# EAGLE design Astable-555-Timer (EAGLE 9.6.2)
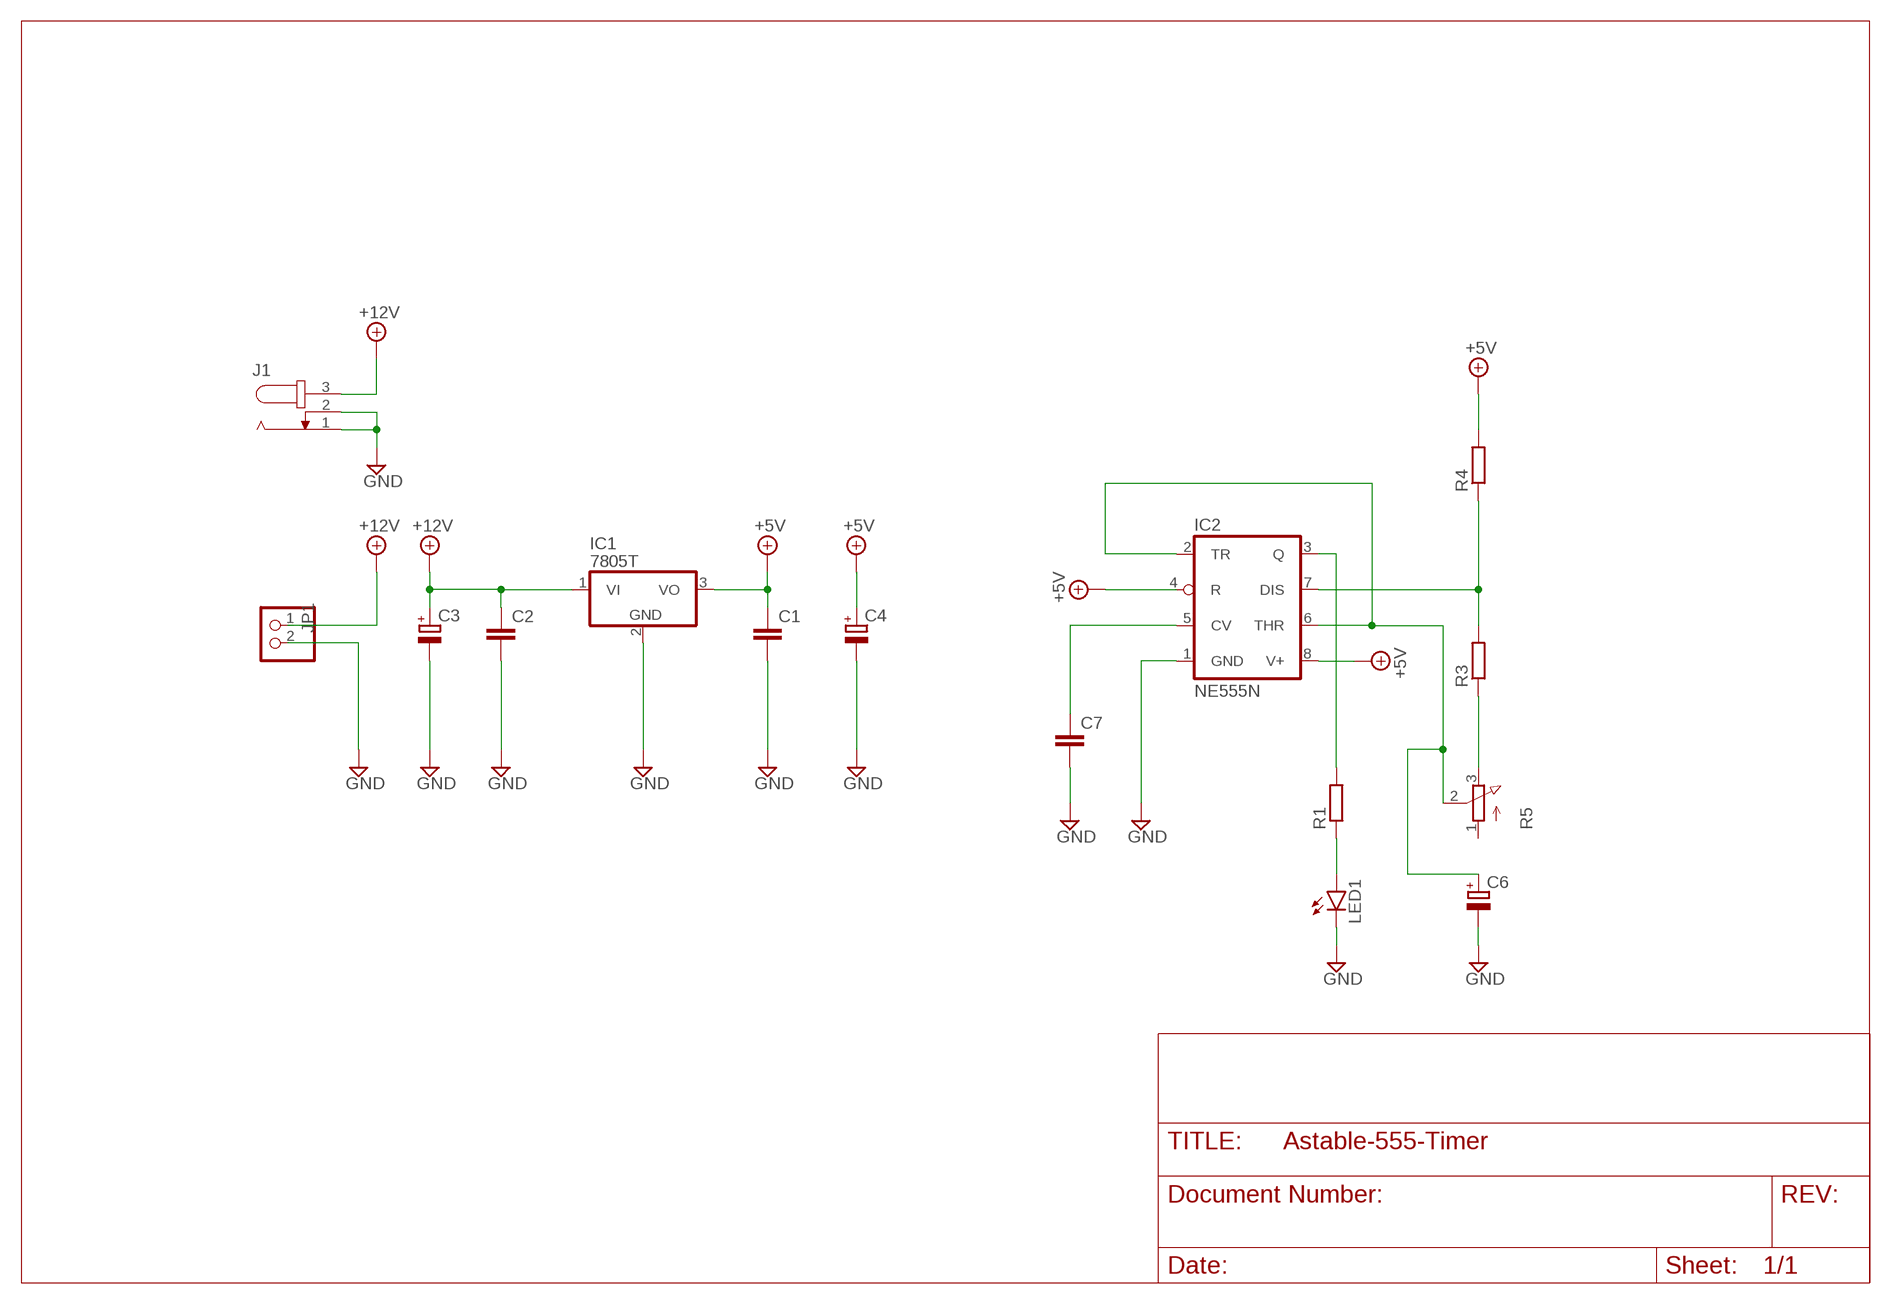
[diagram p0: schematic, sheet 1]

## Parts
C1  C-EU050-030X075  [C050-030X075]
C2  C-EU050-030X075  [C050-030X075]
C3  CPOL-EUE3.5-8  [E3,5-8]
C4  CPOL-EUE3.5-8  [E3,5-8]
C6  CPOL-EUE3.5-8  [E3,5-8]
C7  C-EU050-030X075  [C050-030X075]
IC1  7805T  [TO220H]
IC2  NE555N  [DIL08]
J1  JACK-PLUG1  [SPC4078]
JP1  PINHD-1X2  [1X02]
LED1  LED5MM  [LED5MM]
R1  R-EU_0207/10  [0207/10]
R3  R-EU_0207/10  [0207/10]
R4  R-EU_0207/10  [0207/10]
R5  3RP/1610N  [3RP/1610N]

## Nets
+5V [power]: C1.1 C4.+ IC1.3(VO) IC2.4(R) IC2.8(V+) R4.2
+12V [power]: C2.1 C3.+ IC1.1(VI) J1.3 JP1.1
GND [power]: C1.2 C2.2 C3.- C4.- C6.- C7.2 IC1.2(GND) IC2.1(GND) J1.1 J1.2 JP1.2 LED1.K(C)
N$2: C7.1 IC2.5(CV)
N$3: C6.+ IC2.2(TR) IC2.6(THR) R5.2(S)
N$4: IC2.7(DIS) R3.2 R4.1
N$5: R3.1 R5.3(E)
N$6: LED1.A R1.1
N$7: IC2.3(Q) R1.2
Unconnected: R5.1(A)

## Library data of the parts
C1 C2 C7 = rcl:C-EU: CAPACITOR, European symbol; SPICEPREFIX: C
C3 C4 C6 = rcl:CPOL-EU: POLARIZED CAPACITOR, European symbol; SPICEPREFIX: C
IC1 = linear:78*: Positive VOLTAGE REGULATOR Source: http://cache.national.com/ds/LM/LM78L05.pdf http://www.fairchildsemi.com/ds/LM/LM7805.pdf
IC2 = linear:*555: TIMER
J1 = con-jack:JACK-PLUG: DC POWER JACK Power Jack, DC, Right Angle, Through Hole, Rated 5A at 16VDC, PC Terminals Distributor: Farnell (www.Farnell.de) Drawing: 84N1161.pdf / 84N1162.pdf Manufacturer: SPC Technology (www.spctechnology.com) Type: SPC4077 / SPC 4078; OC_FARNELL: unknown; OC_NEWARK: unknown
JP1 = pinhead:PINHD-1X2: PIN HEADER
LED1 = led:LED: LED OSRAM: - CHIPLED LG R971, LG N971, LY N971, LG Q971, LY Q971, LO R971, LY R971 LH N974, LH R974 LS Q976, LO Q976, LY Q976 LO Q996 - Hyper CHIPLED LW Q18S LB Q993, LB Q99A, LB R99A - SideLED LS A670, LO A670, LY A670, LG A670, LP A670 LB A673, LV A673, LT A673, LW A673 LH A674 LY A675 LS A676, LA A676, LO A676, LY A676, LW A676 LS A679, LY A679, LG A679 - Hyper Micro SIDELED® LS Y876, LA Y876, LO Y876, LY Y876 LT Y87S - SmartLED LW L88C, LW L88S LB L89C, LB L89S, LG L890 LS L89K, LO L89K, LY L89K LS L896, LA L896, LO L896, LY L896 - TOPLED LS T670, LO T670, LY T670, LG T670, LP T670 LSG T670, LSP T670, LSY T670, LOP T670, LYG T670 LG T671, LOG T671, LSG T671 LB T673, LV T673, LT T673, LW T673 LH T674 LS T676, LA T676, LO T676, LY T676, LB T676, LH T676, LSB T676, LW T676 LB T67C, LV T67C, LT T67C, LS T67K, LO T67K, LY T67K, LW E67C LS E67B, LA E67B, LO E67B, LY E67B, LB E67C, LV E67C, LT E67C LW T67C LS T679, LY T679, LG T679 LS T770, LO T770, LY T770, LG T770, LP T770 LB T773, LV T773, LT T773, LW T773 LH T774 LS E675, LA E675, LY E675, LS T675 LS T776, LA T776, LO T776, LY T776, LB T776 LHGB T686 LT T68C, LB T68C - Hyper Mini TOPLED® LB M676 - Mini TOPLED Santana® LG M470 LS M47K, LO M47K, LY M47K Source: http://www.osram.convergy.de LUXEON: - LUMILED® LXK2-PW12-R00, LXK2-PW12-S00, LXK2-PW14-U00, LXK2-PW14-V00 LXK2-PM12-R00, LXK2-PM12-S00, LXK2-PM14-U00 LXK2-PE12-Q00, LXK2-PE12-R00, LXK2-PE12-S00, LXK2-PE14-T00, LXK2-PE14-U00 LXK2-PB12-K00, LXK2-PB12-L00, LXK2-PB12-M00, LXK2-PB14-N00, LXK2-PB14-P00, LXK2-PB14-Q00 LXK2-PR12-L00, LXK2-PR12-M00, LXK2-PR14-Q00, LXK2-PR14-R00 LXK2-PD12-Q00, LXK2-PD12-R00, LXK2-PD12-S00 LXK2-PH12-R00, LXK2-PH12-S00 LXK2-PL12-P00, LXK2-PL12-Q00, LXK2-PL12-R00 Source: www.luxeon.com KINGBRIGHT: KA-3528ASYC Source: www.kingbright.com
R1 R3 R4 = rcl:R-EU_: RESISTOR, European symbol; SPICEPREFIX: R
R5 = pot:3RP/1610N: 16mm Potentiometer one level Source: http://www.alphapotentiometers.net/html/16mm_pot_2.html

## Net classes
0 default: width 0.305 mm, drill 0.305 mm, clearance 0.254 mm
1 power: width 0.406 mm, drill 0.406 mm, clearance 0.305 mm

## Board
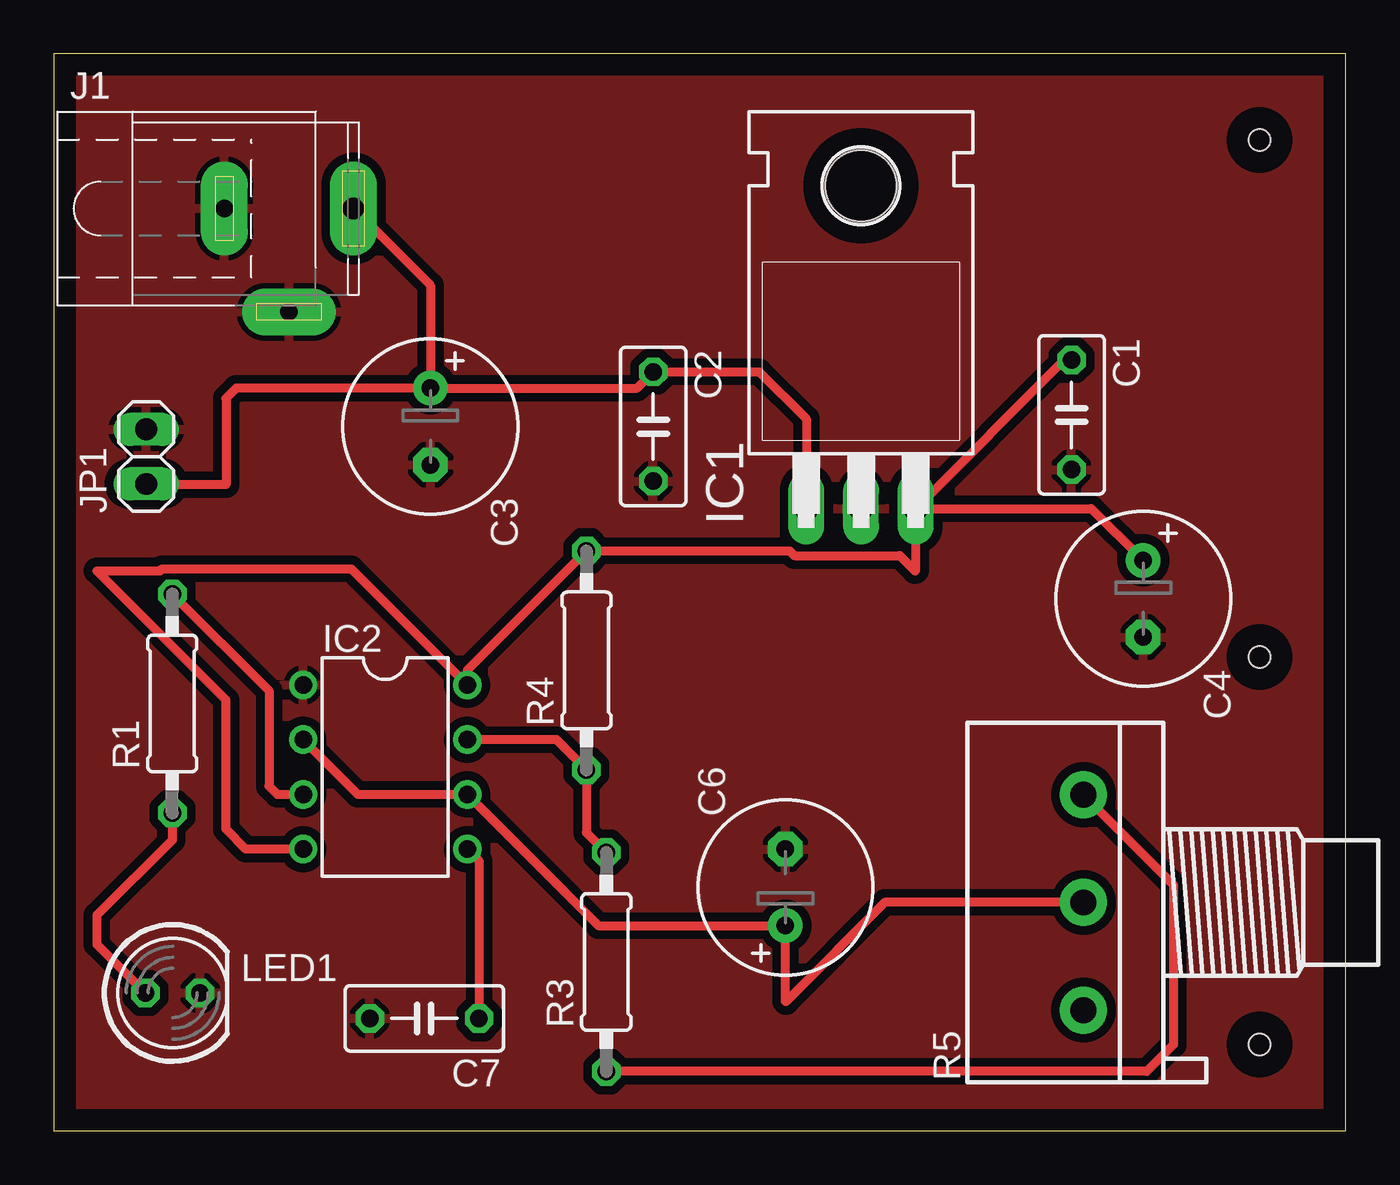
[diagram p1: board, top side]

Size 60 x 50 mm. Coordinates in mm from the lower left corner, seen from the top.
Outline: 0,0 60,0 60,50 0,50 0,0
Copper layers (1*16): Top 0.035mm / dielectric 1.5mm / Bottom 0.035mm
Design rules "default": minimum track width 6mil, minimum drill 0.35mm, track to track 6mil, track to pad 6mil, pad to pad 6mil, via to via 6mil, smd to smd 6mil, copper to edge 40mil, drill to drill 6mil, minimum pad ring 10mil, minimum via ring 8mil, stop-mask expansion 4mil, vias tented up to drill 0mil, thermal gap 10mil
Holes 1 mm at 56,46 56,4 56,22

### Footprints (pad centres in the part's own frame; a part is rotated, then mirrored left to right if it is on the bottom)
C050-030X075 = drill 0.813 octagon: 1 -2.54,0; 2 2.54,0
E3,5-8 = drill 0.813 pad 1.6: + -1.778,0 | drill 0.813 pad 1.6 octagon: - 1.778,0
TO220H = drill 1.118 long: 1 -2.54,-10.16; 2 0,-10.16; 3 2.54,-10.16 | hole 3.302: 0,4.826
DIL08 = drill 0.813 pad 1.27: 1 -3.81,-3.81; 2 -1.27,-3.81; 3 1.27,-3.81; 4 3.81,-3.81; 5 3.81,3.81; 6 1.27,3.81; 7 -1.27,3.81; 8 -3.81,3.81
SPC4078 = drill 0.8 pad 2.184 long: 1 -3,0; 2 0,-4.8 | drill 1 pad 2.184 long: 3 3,0
1X02 = drill 1.016 long: 1 -1.27,0; 2 1.27,0
LED5MM = drill 0.813 octagon: A -1.27,0; K 1.27,0
0207/10 = drill 0.813 octagon: 1 -5.08,0; 2 5.08,0
3RP/1610N = drill 1.2 pad 2.184: 1 -5,0; 2 0,0; 3 5,0

### Placement (x,y rotation side)
C1  47.27,33.24 270 top
C2  27.84,32.7 270 top
C3  17.49,32.7 270 top
C4  50.6,24.7 270 top
C6  33.98,11.3 90 top
C7  17.21,5.22 180 top
IC1  37.49,39.05 0 top
IC2  15.39,16.89 270 top
J1  10.92,42.82 0 top
JP1  4.29,31.3 90 top
LED1  5.52,6.4 0 top
R1  5.5,19.84 90 top
R3  25.66,7.84 90 top
R4  24.74,21.84 90 top
R5  47.82,10.6 90 top

### Tracks (layer width: path | path; a pad name or v marks a point on that pad's centre or on a via)
+5V
  Top 0.406: IC1.3 46.92,35.78 C1.1 | IC1.3 48.19,28.89 C4.+ | IC2.4 8.92,13.08 8,14 8,20 2,26 4.93,26 5.02,26.09 13.81,26.09 IC2.8 19.2,21.38 R4.2 34.18,26.92 34.39,26.71 39.29,26.71 40,26 40.03,26.03 IC1.3
+12V
  Top 0.406: J1.3 17.49,39.25 C3.+ | C3.+ 27.08,34.48 C2.1 32.76,35.24 34.95,33.05 IC1.1 | C3.+ 8.48,34.48 8,34 8,30 4.32,30 JP1.1
GND
  pour Top (isolate 0.406): 0,50 60,50 60,0 0,0
N$2
  Top 0.406: IC2.5 19.75,12.53 C7.1
N$3
  Top 0.406: R5.2 38.6,10.6 34,6 33.98,6.02 C6.+ 25.3,9.52 IC2.6 14.12,15.62 IC2.2
N$4
  Top 0.406: R3.2 24.74,13.84 R4.1 23.34,18.16 IC2.7
N$5
  Top 0.406: R5.3 52,11.42 52,4 50.76,2.76 R3.1
N$6
  Top 0.406: R1.1 5.5,13.5 2,10 2,8.65 LED1.A
N$7
  Top 0.406: R1.2 10,20.42 10,16 10.38,15.62 IC2.3